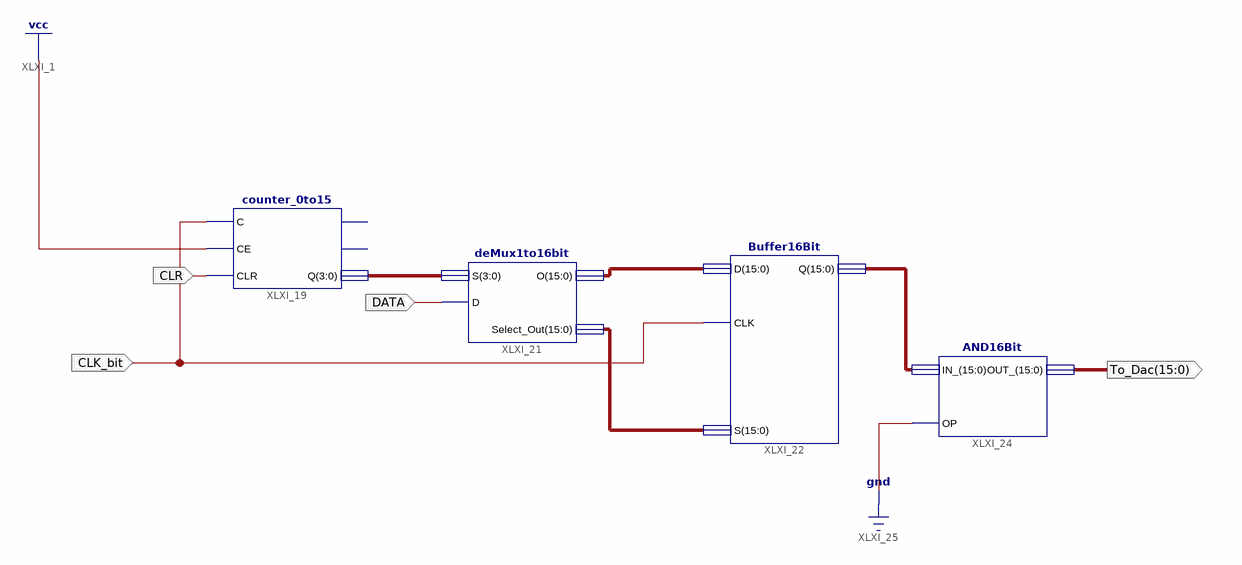
[diagram p0: schematic sheet 1]
// Xilinx ISE schematic DAC.sch (spartan6) as structural Verilog: 4 symbols, 4 ports
module DAC (
  input  DATA,
  input  CLK_bit,
  input  CLR,
  output [15:0] To_Dac
);

  wire [3:0] XLXN_45;
  wire [15:0] XLXN_51, XLXN_52, XLXN_54;

  deMux1to16bit XLXI_21 (.S(XLXN_45), .D(DATA), .O(XLXN_51), .Select_Out(XLXN_52));
  counter_0to15 XLXI_19 (.C(CLK_bit), .CE(1'b1), .CLR(CLR), .Q(XLXN_45));  // open: CEO, TC
  AND16Bit XLXI_24 (.IN_(XLXN_54), .OP(1'b0), .OUT_(To_Dac));
  Buffer16Bit XLXI_22 (.D(XLXN_51), .CLK(CLK_bit), .S(XLXN_52), .Q(XLXN_54));

  // Notes on the sheet:
  //   CLOCK_DEDICATED_ROUTE on signal CLK_bit = False
endmodule
